# Altium schematic sheet Page-8.schdoc: Power Supply Unit
size 301 x 212 mm; CompanyName: InSYS; DrawnBy: NaveenKumar; Revision: 2.0; SheetNumber: 8; SheetTotal: 10; Title2: Gateway
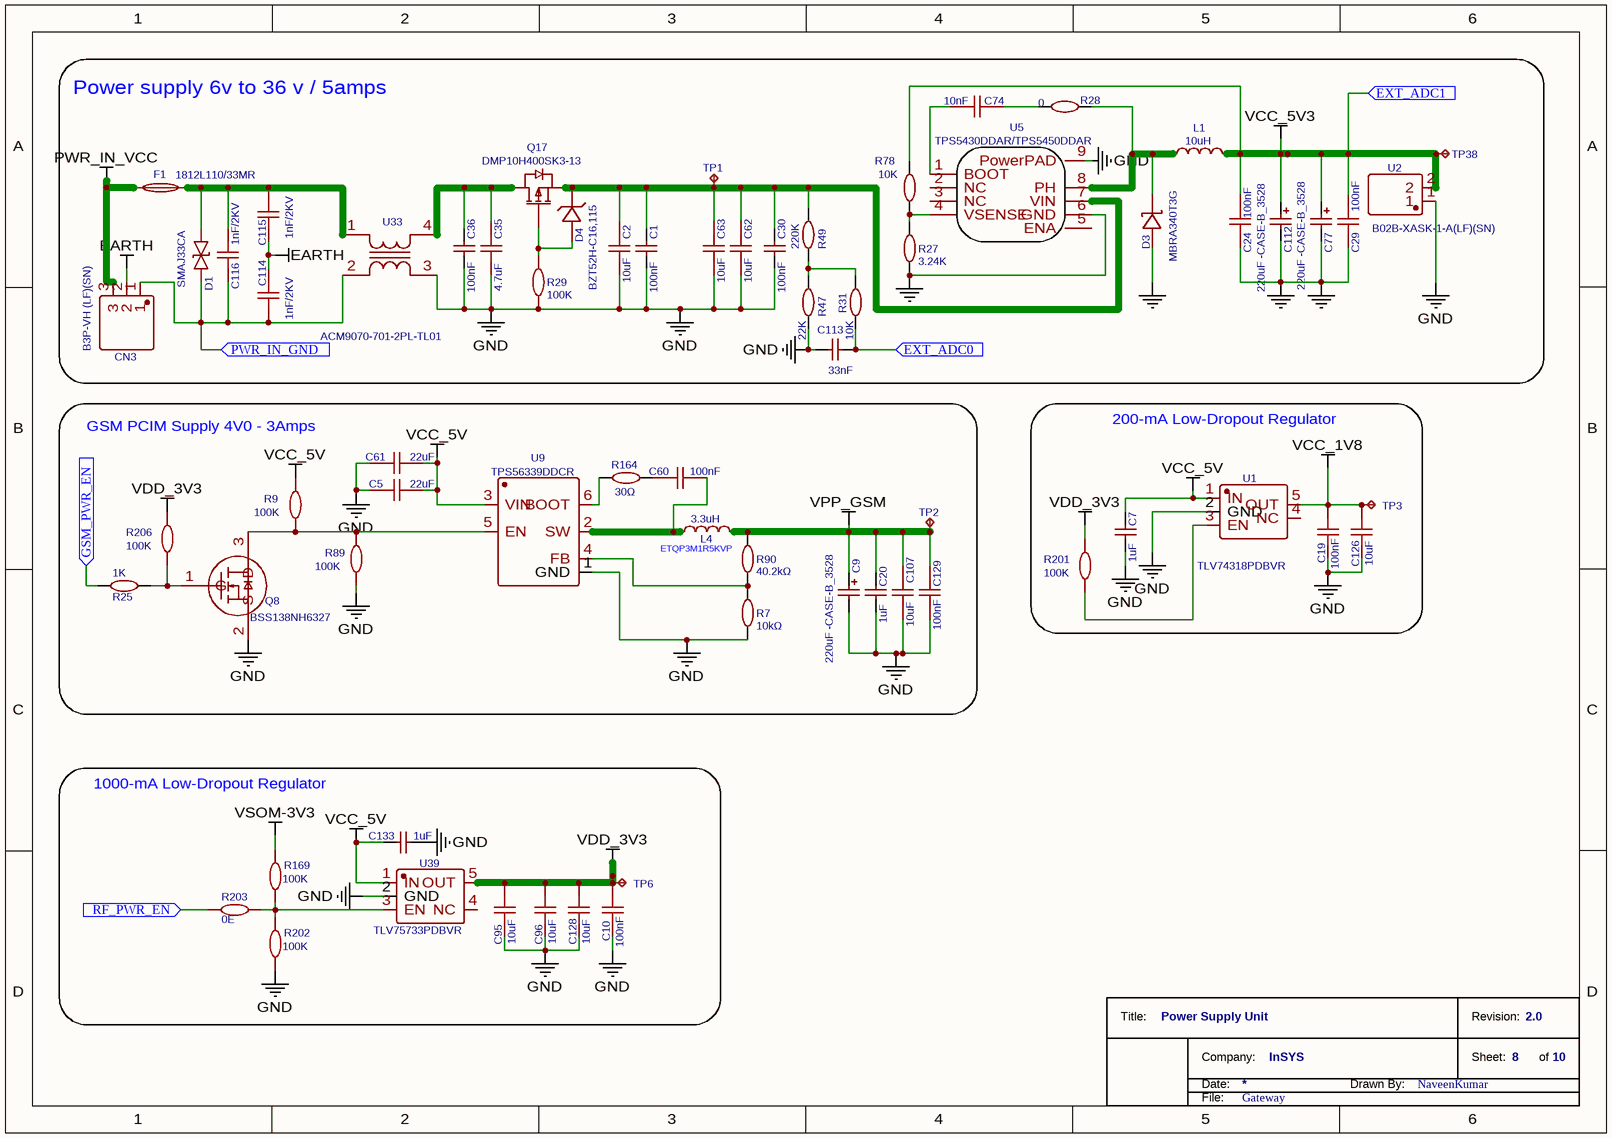
[diagram p0: Page-8.schdoc]

## Parts
*  TitleBlock_1  (value not drawn)  (graphical)
C1  100nF  [GWAY_Capacitor_0805]
C2  10uF  [GWAY_Capacitor_1206]
C5  22uF  [GWAY_Capacitor_0805]
C7  1uF  [GWAY_Capacitor_0603]
C9  220uF -CASE-B_3528  [GWAY_CASE-B]
C10  100nF  [GWAY_Capacitor_0603]
C19  100nF  [GWAY_Capacitor_0603]
C20  1uF  [GWAY_Capacitor_0603]
C24  100nF  [GWAY_Capacitor_0603]
C29  100nF  [GWAY_Capacitor_0603]
C30  100nF  [GWAY_Capacitor_0805]
C35  4.7uF  [GWAY_CAP1210]
C36  100nF  [GWAY_Capacitor_0805]
C60  100nF  [GWAY_Capacitor_0603]
C61  22uF  [GWAY_Capacitor_0805]
C62  10uF  [GWAY_Capacitor_1206]
C63  10uF  [GWAY_Capacitor_1206]
C74  10nF  [GWAY_Capacitor_0603]
C77  220uF -CASE-B_3528  [GWAY_CASE-B]
C95  10uF  [GWAY_Capacitor_0805]
C96  10uF  [GWAY_Capacitor_0805]
C107  10uF  [GWAY_Capacitor_0805]
C112  220uF -CASE-B_3528  [GWAY_CASE-B]
C113  33nF  [GWAY_Capacitor_0603]
C114  1nF/2KV  [GWAY_Capacitor_1206]
C115  1nF/2KV  [GWAY_Capacitor_1206]
C116  1nF/2KV  [GWAY_Capacitor_1206]
C126  10uF  [GWAY_Capacitor_0805]
C128  10uF  [GWAY_Capacitor_0805]
C129  100nF  [GWAY_Capacitor_0603]
C133  1uF  [GWAY_Capacitor_0603]
CN3  B3P-VH (LF)(SN)  [GWAY_B3P-VH-LF-SN]
D1  SMAJ33CA  [GWAY_Diode_SMA_DO214AC]
D3  MBRA340T3G  [GWAY_Diode_SMA_DO214AC]
D4  BZT52H-C16,115  [GWAY_SOD123F]
F1  1812L110/33MR  [GWAY_FUSE1812L110/33MR]
L1  10uH  [GWAY_ETQP5M100YFC]
L4  3.3uH  [GWAY_ETQ-P3M_KVP]
Q8  BSS138NH6327  [GWAY_SOT23-3PIN]
Q17  DMP10H400SK3-13  [GWAY_P-CH MOSFET_DMP10H400SK313]
R7  10kΩ  [GWAY_Resistor_0603]
R9  100K  [GWAY_Resistor_0603]
R25  1K  [GWAY_Resistor_0603]
R27  3.24K  [GWAY_Resistor_0603]
R28  0  [GWAY_Resistor_0603]
R29  100K  [GWAY_Resistor_0603]
R31  10K  [GWAY_Resistor_0603]
R47  22K  [GWAY_Resistor_0805]
R49  220K  [GWAY_Resistor_0805]
R78  10K  [GWAY_Resistor_0603]
R89  100K  [GWAY_Resistor_0603]
R90  40.2kΩ  [GWAY_Resistor_0603]
R164  30Ω  [GWAY_Resistor_0603]
R169  100K  [GWAY_Resistor_0603]
R201  100K  [GWAY_Resistor_0603]
R202  100K  [GWAY_Resistor_0603]
R203  0E  [GWAY_Resistor_0603]
R206  100K  [GWAY_Resistor_0603]
TP1  TP-052-TJ  [GWAY_TESTPOINT1]  (value not drawn)
TP2  TP-052-TJ  [GWAY_TESTPOINT1]  (value not drawn)
TP3  TP-052-TJ  [GWAY_TESTPOINT1]  (value not drawn)
TP6  TP-052-TJ  [GWAY_TESTPOINT1]  (value not drawn)
TP38  TP-052-TJ  [GWAY_TESTPOINT1]  (value not drawn)
U1  TLV74318PDBVR  [GWAY_SOT23-5PIN]
U2  B02B-XASK-1-A(LF)(SN)  [GWAY_B2P-VH-LF-SN]
U5  TPS5430DDAR/TPS5450DDAR  [GWAY_SOIC8_POWERPAD]
U9  TPS56339DDCR  [GWAY_TSOT23-6PIN]
U33  ACM9070-701-2PL-TL01  [GWay_ACM9070-701-2PL-TL01]
U39  TLV75733PDBVR  [GWAY_SOT23-5PIN]

## Blocks framed on the sheet
Power supply 6v to 36 v / 5amps: C1 C2 C24 C29 C30 C35 C36 C62 C63 C74 C77 C112-C116 CN3 D1 D3 D4 F1 L1 Q17 R27-R29 R31 R47 R49 R78 TP1 TP38 U2 U5 U33
GSM PCIM Supply 4V0 - 3Amps: C5 C9 C20 C60 C61 C107 C129 L4 Q8 R7 R9 R25 R89 R90 R164 R206 TP2 U9
200-mA Low-Dropout Regulator: C7 C19 C126 R201 TP3 U1
1000-mA Low-Dropout Regulator: C10 C95 C96 C128 C133 R169 R202 R203 TP6 U39

## Ports
EXT_ADC0 (in), EXT_ADC1 (in), GSM_PWR_EN (in), PWR_IN_GND (in), RF_PWR_EN (in)

## Nets
EARTH: C114.1 C115.2 CN3.2
GND: C1.1 C2.1 C5.2 C7.2 C9.2 C10.1 C19.1 C20.2 C24.2 C29.2 C30.1 C35.1 C36.1 C61.2 C62.1 C63.1 C77.2 C95.1 C96.1 C107.1 C112.2 C113.2 C126.1 C128.1 C129.1 C133.2 D3.1(A) Q8.2(S) R7.1 R27.1 R29.1 R47.1 R89.1 R202.1 U1.2(GND) U2.1 U5.6(GND) U5.9(PowerPAD) U9.1(GND) U33.3 U39.2(GND)
PWR_IN_VCC: CN3.3 F1.1
VCC_1V8: C19.2 C126.2 TP3.1 U1.5(OUT)
VCC_5V: C5.1 C7.1 C61.1 C133.1 R9.2 U1.1(IN) U9.3(VIN) U39.1(IN)
VCC_5V3: C24.1 C29.1 C77.1 C112.1 L1.2 R78.1 TP38.1 U2.2 ; port EXT_ADC1
VDD_3V3: C10.2 C95.2 C96.2 C128.2 R201.2 R206.2 TP6.1 U39.5(OUT)
VPP_GSM: C9.1 C20.1 C107.2 C129.2 L4.2 R90.2 TP2.1
VSOM-3V3: R169.2
EXT_ADC0: C113.1 R31.2 ; port EXT_ADC0
GSM_PWR_EN: R25.2 ; port GSM_PWR_EN
PWR_IN_GND: C114.2 C116.2 CN3.1 D1.1(K) U33.2 ; port PWR_IN_GND
RF_PWR_EN: R203.2 ; port RF_PWR_EN
NetC1_2: C1.2 C2.2 C30.2 C62.2 C63.2 D4.1(K) Q17.3(S) R49.2 TP1.1 U5.7(VIN)
NetC35_2: C35.2 C36.2 Q17.2(D) U33.4
NetC60_1: C60.1 L4.1 U9.2(SW)
NetC60_2: C60.2 R164.2
NetC74_1: C74.1 R28.1
NetC74_2: C74.2 U5.1(BOOT)
NetC115_1: C115.1 C116.1 D1.2(A) F1.2 U33.1
NetD3_2: D3.2(K) L1.1 R28.2 U5.8(PH)
NetD4_2: D4.2(A) Q17.1(G) R29.2
NetQ8_1: Q8.1(G) R25.1 R206.1
NetQ8_3: Q8.3(D) R9.1 R89.2 U9.5(EN)
NetR7_2: R7.2 R90.1 U9.4(FB)
NetR27_2: R27.2 R78.2 U5.4(VSENSE)
NetR31_1: R31.1 R47.2 R49.1
NetR164_1: R164.1 U9.6(BOOT)
NetR169_1: R169.1 R202.2 R203.1 U39.3(EN)
NetR201_1: R201.1 U1.3(EN)

Not connected (* = marked no-connect by the designer): U1 4(NC); U5 2(NC) 3(NC) 5(ENA); U39 4(NC)

## Notes on the sheet
- (near L4) ETQP3M1R5KVP
- (in symbol TitleBlock_1) Title:; Revision:; Company:; Sheet:; of; Date:; Drawn By:; File:

## Library data of the parts
* = TitleBlock_1: TitleBlock  No-2; TitleName: *; Company: *; Drawn By: *; File: *
C1 C30 C36 = 100nF: Manufacturer Part: CL21B104KCFNNNE; Manufacturer: SAMSUNG(三星); nameAlias: Capacitance; Supplier: LCSC; Supplier Part: C28233; JLCPCB Part Class: Basic Part; spicePre: C; spiceSymbolName: CL21B104KCFNNNE
C2 C62 C63 = 10uF: Manufacturer: SAMSUNG(三星); Manufacturer Part: CL31B106KBHNNNE; nameAlias: Capacitance; Supplier: LCSC; Supplier Part: C89632; JLCPCB Part Class: Extended Part; spicePre: C; spiceSymbolName: CL31B106KBHNNNE
C5 C61 = 22uF: Manufacturer: SAMSUNG; Manufacturer Part: CL21A226MQQNNNE; nameAlias: Capacitance; Supplier: LCSC; Supplier Part: C5674; spicePre: C; spiceSymbolName: CL21A226MQQNNNE
C7 C20 C133 = 1uF: Manufacturer Part: CL10B105KA8NNNC; Manufacturer: SAMSUNG(三星); nameAlias: Capacitance; Supplier: LCSC; Supplier Part: C29936; JLCPCB Part Class: Extended Part; spicePre: C; spiceSymbolName: CL10B105KA8NNNC
C9 C77 C112 = 220uF -CASE-B_3528: Manufacturer: PANASONIC; Manufacturer Part: 6TPE220MAZB; nameAlias: Capacitance; SMT Type: Extend; Supplier: LCSC; Supplier Part: C79111; LCSC Assembly: Yes; spicePre: C; spiceSymbolName: 6TPE220MAZB
C10 C19 C24 C29 C60 C129 = 100nF: Manufacturer: SAMSUNG; Manufacturer Part: CL10B104KB8NNNC; nameAlias: Capacitance; Supplier: LCSC; Supplier Part: C1591; spicePre: C; spiceSymbolName: CL10B104KB8NNNC
C35 = 4.7uF: Manufacturer: TAIYO YUDEN(太诱); Manufacturer Part: HMK325C7475KN-TE; nameAlias: Capacitance; Contributor: LCSC; Supplier: LCSC; Supplier Part: C697607; JLCPCB Part Class: Extended Part; spicePre: C; spiceSymbolName: HMK325C7475KN-TE
C74 = 10nF: Manufacturer: Samsung Electro-Mechanics; Manufacturer Part: CL10B103KB8NFNC; nameAlias: Capacitance; Contributor: LCSC; Supplier: LCSC; Supplier Part: C307477; spicePre: C; spiceSymbolName: CL10B103KB8NFNC
C95 C96 C107 C126 C128 = 10uF: Manufacturer: SAMSUNG(三星); Manufacturer Part: CL21B106KOQNNNE; nameAlias: Capacitance; Supplier: LCSC; Supplier Part: C95841; JLCPCB Part Class: Extended Part; spicePre: C; spiceSymbolName: CL21B106KOQNNNE
C113 = 33nF: Manufacturer Part: CL10B333KB8NNNC; Manufacturer: SAMSUNG; nameAlias: Capacitance; SMT Type: Basic; Supplier: LCSC; LCSC Assembly: Yes; Supplier Part: C21117; spicePre: C; spiceSymbolName: CL10B333KB8NNNC
C114-C116 = 1nF/2KV: Manufacturer: Walsin Tech Corp; Manufacturer Part: 1206B102K202CT; nameAlias: Capacitance; Contributor: LCSC; Supplier: LCSC; Supplier Part: C303946; spicePre: C; spiceSymbolName: 1206B102K202CT
CN3 = B3P-VH (LF)(SN): Manufacturer: JST Sales America; Contributor: LCSC; Supplier: LCSC; Supplier Part: C160316; Manufacturer Part: -; JLCPCB Part Class: Extended Part; spicePre: C; spiceSymbolName: B3P-VH (LF)(SN)
D1 = SMAJ33CA: Manufacturer: Littelfuse; Contributor: LCSC; SMT Type: Extend; Supplier: LCSC; Supplier Part: C148231; Manufacturer Part: SMAJ33CA; LCSC Assembly: Yes; spicePre: D
D3 = MBRA340T3G: Manufacturer: ON; SMT Type: Extend; Supplier: LCSC; Manufacturer Part: MBRA340T3G; image: //image.lceda.cn/szlcsc/C26178.jpg; Supplier Part: C26178; LCSC Assembly: Yes; spicePre: D
D4 = BZT52H-C16,115: Manufacturer: Nexperia(安世); Contributor: LCSC; Supplier: LCSC; Supplier Part: C179380; Manufacturer Part: BZT52H-C16,115; JLCPCB Part Class: Extended Part; spicePre: D; spiceSymbolName: BZT52H-C16,115
F1 = 1812L110/33MR: Manufacturer: Littelfuse; Contributor: LCSC; Supplier: LCSC; Supplier Part: C142747; Manufacturer Part: 1812L110/33MR; spicePre: F
L1 = 10uH: Manufacturer: PANASONIC; Manufacturer Part: ETQP5M100YFC; nameAlias: Inductance; Contributor: LCSC; Supplier: LCSC; Supplier Part: C409627; JLCPCB Part Class: Extended Part; spicePre: L; spiceSymbolName: ETQP5M100YFC
L4 = 3.3uH: Manufacturer Part: TDK; Manufacturer: ETQP3M3R3KVP; nameAlias: Value; JLCPCB Part Class: Extended Part; spicePre: L; spiceSymbolName: SPM6530T-2R2M; Supplier: LCSC; Supplier Part: C542316
Q8 = BSS138NH6327: Manufacturer: Infineon(英飞凌); Contributor: LCSC; Supplier: LCSC; Manufacturer Part: BSS138NH6327; Supplier Part: C94638; JLCPCB Part Class: Extended Part; spicePre: Q; spiceSymbolName: BSS138NH6327
Q17 = DMP10H400SK3-13: Manufacturer: DIODES(美台); Contributor: LCSC; Supplier: LCSC; Supplier Part: C177034; Manufacturer Part: DMP10H400SK3-13; JLCPCB Part Class: Extended Part; spicePre: Q; spiceSymbolName: DMP10H400SK3-13
R7 = 10kΩ: Manufacturer: YAGEO(国巨); nameAlias: Value; Supplier: LCSC; Supplier Part: C98220; JLCPCB Part Class: Extended Part; spicePre: R; spiceSymbolName: RC0603FR-0710KL
R9 R29 R89 R169 R201-R203 R206 = 100K: Manufacturer: YAGEO; Manufacturer Part: RC0603FR-07100KL; nameAlias: Resistance (Ohms); Contributor: LCSC; Supplier: LCSC; Supplier Part: C14675; spicePre: R; spiceSymbolName: RC0603FR-07100KL
R25 = 1K: Manufacturer Part: RC0603FR-071KL; Manufacturer: YAGEO; nameAlias: Resistance (Ohms); Supplier: LCSC; Supplier Part: C22548; spicePre: R; spiceSymbolName: RC0603FR-071KL
R27 = 3.24K: Manufacturer: YAGEO; Manufacturer Part: RC0603FR-073KL; nameAlias: Resistance (Ohms); Supplier: LCSC; Supplier Part: C126358; spicePre: R; spiceSymbolName: RC0603FR-073KL
R28 = 0: Manufacturer: YAGEO; Manufacturer Part: RC0603FR-070RL; nameAlias: Resistance (Ohms); Supplier: LCSC; Supplier Part: C100044; spicePre: R; spiceSymbolName: RC0603FR-070RL
R31 R78 = 10K: Manufacturer: YAGEO; Manufacturer Part: RC0603JR-0710KL; nameAlias: Resistance (Ohms); Supplier: LCSC; Supplier Part: C99198; spicePre: R; spiceSymbolName: RC0603JR-0710KL
R47 = 22K: Manufacturer: YAGEO; Manufacturer Part: RC0805JR-0722KL; nameAlias: Resistance (Ohms); Supplier: LCSC; Supplier Part: C114231; spicePre: R; spiceSymbolName: RC0805JR-0722KL
R49 = 220K: Manufacturer: YAGEO; Manufacturer Part: RC0805FR-07220KL; nameAlias: Resistance (Ohms); Supplier: LCSC; Supplier Part: C137568; spicePre: R; spiceSymbolName: RC0805FR-07220KL
R90 = 40.2kΩ: Manufacturer: YAGEO(国巨); nameAlias: Value; Supplier: LCSC; Supplier Part: C137723; JLCPCB Part Class: Extended Part; spicePre: R; spiceSymbolName: RC0603FR-0740K2L
R164 = 30Ω: Manufacturer: YAGEO(国巨); nameAlias: Value; Supplier: LCSC; Supplier Part: C128060; JLCPCB Part Class: Extended Part; spicePre: R; spiceSymbolName: RC0603FR-0730RL
U1 = TLV74318PDBVR: Manufacturer: Texas Instruments; Contributor: LCSC; Supplier: LCSC; Supplier Part: C485152; Manufacturer Part: TLV74318PDBVR; JLCPCB Part Class: Extended Part; spicePre: U; spiceSymbolName: TLV74318PDBVR
U2 = B02B-XASK-1-A(LF)(SN): Manufacturer: JST; Contributor: LCSC; Supplier: LCSC; Supplier Part: C265077; Manufacturer Part: B02B-XASK-1-A(LF)(SN); JLCPCB Part Class: Extended Part; spicePre: U; spiceSymbolName: B02B-XASK-1-A(LF)(SN)
U5 = TPS5430DDAR/TPS5450DDAR: Manufacturer: TI; SMT Type: Basic; Supplier: LCSC; Manufacturer Part: TPS5430DDAR; LCSC Assembly: Yes; image: //image.lceda.cn/szlcsc/C9864.jpg; Supplier Part: C9864; spicePre: U
U9 = TPS56339DDCR: Manufacturer: TI; Contributor: jinyoung00; Supplier: LCSC; Supplier Part: C2071106; Manufacturer Part: TPS56339DDCR; JLCPCB Part Class: Extended Part; spicePre: U; spiceSymbolName: TPS56339DDCR
U33 = ACM9070-701-2PL-TL01: Manufacturer: TDK; Contributor: LCSC; Supplier: LCSC; Manufacturer Part: ACM9070-701-2PL-TL01; Supplier Part: C14594; JLCPCB Part Class: Extended Part; spicePre: U; spiceSymbolName: ACM9070-701-2PL-TL01
U39 = TLV75733PDBVR: Manufacturer: Texas Instruments; Contributor: LCSC; Supplier: LCSC; Supplier Part: C485517; Manufacturer Part: TLV75733PDBVR; spicePre: U; spiceSymbolName: TLV75733PDBVR
TP1-TP3 TP6 TP38 = TP-052-TJ: Manufacturer Part: ?; spicePre: T